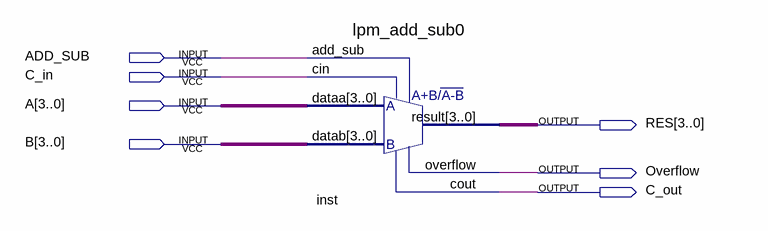
[diagram p0: schematic sheet]
// Quartus schematic lab_8_1.bdf as structural Verilog: 1 symbols, 7 pins
module lab_8_1 (
  input  ADD_SUB,
  input  C_in,
  input  [3:0] A,
  input  [3:0] B,
  output [3:0] RES,
  output Overflow,
  output C_out
);

  lpm_add_sub0 inst (
    .dataa(A), .datab(B), .add_sub(ADD_SUB), .cin(C_in), .result(RES), .overflow(Overflow), .cout(C_out));
endmodule
